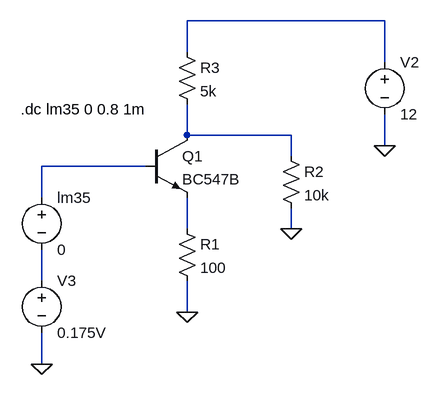
[diagram p0: schematic amplifier.asc]
amplifier.asc, the LTspice schematic file:
Version 4
SHEET 1 880 680
WIRE 576 16 272 16
WIRE 272 64 272 16
WIRE 576 80 576 16
WIRE 272 192 272 144
WIRE 432 192 272 192
WIRE 576 208 576 160
WIRE 432 224 432 192
WIRE 208 240 48 240
WIRE 48 288 48 240
WIRE 272 336 272 288
WIRE 432 336 432 304
WIRE 48 416 48 368
WIRE 272 464 272 416
WIRE 48 544 48 496
FLAG 432 336 0
FLAG 48 544 0
FLAG 272 464 0
FLAG 576 208 0
SYMBOL res 256 320 R0
SYMATTR InstName R1
SYMATTR Value 100
SYMBOL res 416 208 R0
SYMATTR InstName R2
SYMATTR Value 10k
SYMBOL res 256 48 R0
SYMATTR InstName R3
SYMATTR Value 5k
SYMBOL npn 208 192 R0
SYMATTR InstName Q1
SYMATTR Value BC547B
SYMBOL voltage 48 272 R0
WINDOW 123 0 0 Left 0
WINDOW 39 0 0 Left 0
SYMATTR InstName lm35
SYMATTR Value 0
SYMBOL voltage 576 64 R0
WINDOW 123 0 0 Left 0
WINDOW 39 0 0 Left 0
SYMATTR InstName V2
SYMATTR Value 12
SYMBOL voltage 48 400 R0
WINDOW 123 0 0 Left 0
WINDOW 39 0 0 Left 0
SYMATTR InstName V3
SYMATTR Value 0.175V
TEXT 16 152 Left 2 !.dc lm35 0 0.8 1m

The netlist it stands for:
* amplifier.asc
R1 N004 0 100
R2 N002 0 10k
R3 N001 N002 5k
Q1 N002 N003 N004 0 BC547B
V§lm35 N003 N005 0
V2 N001 0 12
V3 N005 0 0.175V
.model NPN NPN
.model PNP PNP
.lib standard.bjt
.dc lm35 0 0.8 1m
.backanno
.end